# Altium schematic sheet Sheet1.SchDoc (part 2 of 2)
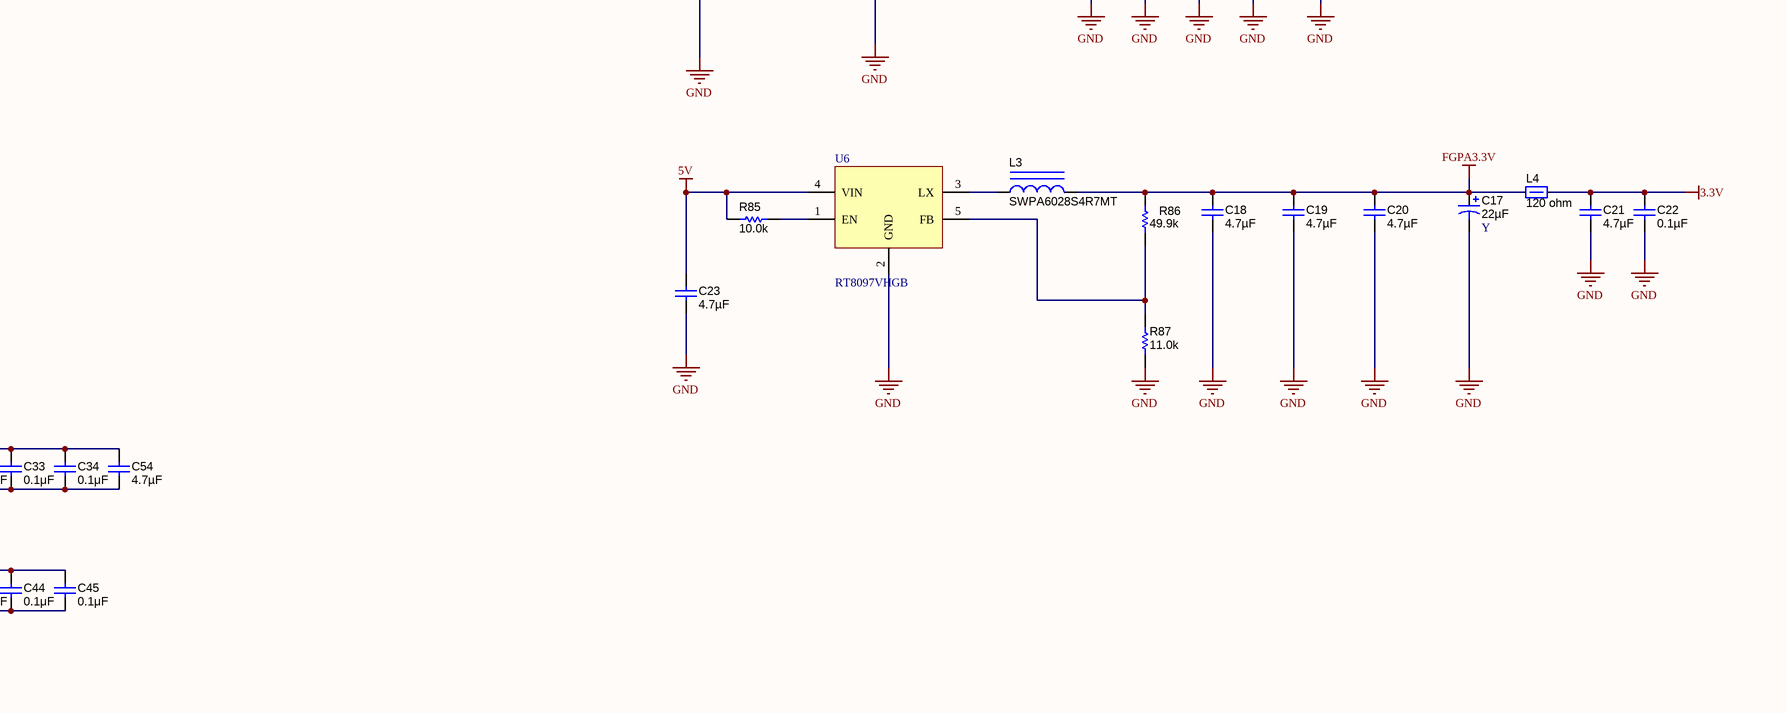
[diagram p5: Sheet1.SchDoc, bottom middle]

## Library data of the parts
D9 DD1 = PMEG2010AEH,115: Diode, Schottky, 20 V, 1 A, SOD-123F; Manufacturer: NXP Semiconductor; U/M: EA; Vf_V: 0.43; Value: 20V; Value1: 1A; Value2: 0.43V; Io_A: 1; Vr_V: 20; TJmax_C: 150; IGNORE: N; CompType: Diode; SymbolVersion: 2008-12-08; PartNumber: 1N5819; PackageReference: SOD-123F; MountType: SMT; Type: Schottky; RoHS: Y; Published: 2008-06-26; Publisher: Texas Instruments; LatestRevisionDate: 2015-04-30; ComponentLink1Description: Datasheet link; ComponentLink1URL: http://www.nxp.com/documents/data_sheet/PMEG2010AEH_PMEG2010AET.pdf; Supplier 1: Digi-Key; Supplier Part Number 1: 568-4112-1-ND; Supplier 2: Mouser; Supplier Part Number 2: 771-PMEG2010AEH-T/R; Supplier 3: Farnell; Supplier Part Number 3: 2371105
R81 R25 R26 R31 R32 R34 R35 R37 R38 R55 R68 R72 R89 R94-R96 R98 R99 = CRCW04022K21FKED: RES, 2.21 k, 1%, 0.063 W, 0402; Manufacturer: Vishay-Dale; CompType: Resistor; Value: 2.21k; Res_ohm: 2210; Value_Code: 2k21; Tolerance_%: 1; Power_W: 0.063; Value2: 0.063W; VDC_V: 50; TempCo: 100 ppm/C; EIA_Code: E96; U/M: EA; SymbolVersion: 2009-05-29; PartNumber: CRCW04022K21FKED; PackageReference: 0402; RoHS: Y; Value1: 1%; MountType: SMT; Technology: Thick Film; Published: 2008-06-26; Publisher: Texas Instruments; LatestRevisionDate: 2015-05-01; ComponentLink1Description: Datasheet link; ComponentLink1URL: http://www.vishay.com/docs/20035/dcrcwe3.pdf; Supplier 1: Digi-Key; Supplier Part Number 1: 541-2.21KLCT-ND; Supplier 2: Mouser; Supplier Part Number 2: 71-CRCW0402-2.21K-E3; Supplier 3: Farnell; Supplier Part Number 3: 1469689
? D0-D7 D11-D14 POWER1 POWER2 = LED: LED 发光二极管
BUZZER1 = BUZZER_EFBAA14D001: Buzzer, 74 dB min, 25V p-p, 8500pF @ 1kHz，直插9040无源蜂鸣器; Manufacturer: Panasonic; Area: 264,208; Value: {Value}; ComponentHeight: 0.276 inch; PackageReference: 0.550 DIA.; SymbolVersion: 07/31/2009 12:17:27; PartNumber: 直插9040无源蜂鸣器; ComponentLink1Description: AEO Datasheet Link
C1-C4 C6 C24-C27 C29-C31 C33 C34 C36-C38 C40 C41 C42C? C44 C45 C47-C50 C52 C53 C57 = C1005X7R1H104M_1: CAP, CERM, 0.1 μF, 50 V, +/- 20%, X7R, 0402; Manufacturer: TDK; Polarized: N; CompType: Capacitor; Value: 0.1uF; U/M: EA; Cap_F: 0.0000001; Tolerance_%: 20; Value1: Unknown; VDC_V: 50; Value2: 50V; TaMin_C: -55; TaMax_C: 125; SymbolVersion: 2008-07-09; PartNumber: C1005X7R1H104M; PackageReference: 0402; RoHS: Y; MountType: SMT; Technology: Ceramic; TempCo: X7R; Cap_Case: 0402; Published: 2008-06-19; Publisher: Texas Instruments; LatestRevisionDate: 2015-05-02; ComponentLink1Description: Datasheet link; Supplier 1: Digi-Key; Supplier Part Number 1: 445-5933-1-ND; Supplier 2: Farnell; Supplier Part Number 2: 1907278
C8 C64 C65 = GRM1555C1H220FA01D: CAP, CERM, 22 pF, 50 V, +/- 1%, C0G/NP0, 0402; Manufacturer: MuRata; Polarized: N; CompType: Capacitor; Value: 22pF; U/M: EA; Cap_F: 0.000000000022; Tolerance_%: 1; Value1: Unknown; VDC_V: 50; Value2: 50V; TaMin_C: -55; TaMax_C: 125; SymbolVersion: 2008-07-09; PartNumber: GRM1555C1H220FA01D; PackageReference: 0402; RoHS: Y; MountType: SMT; Technology: Ceramic; TempCo: C0G/NP0; Cap_Case: 0402; Published: 2008-06-19; Publisher: Texas Instruments; LatestRevisionDate: 2015-05-02; ComponentLink1Description: Datasheet link; ComponentLink1URL: http://search.murata.co.jp/Ceramy/image/img/A01X/partnumbering_e_01.pdf; Supplier 1: Digi-Key; Supplier Part Number 1: 490-8589-1-ND; Supplier 2: Mouser; Supplier Part Number 2: 81-GRM1555C1H220FA1D
C9 C16 C22 C35 = C1005X7R1H104M: CAP, CERM, 0.1 µF, 50 V, +/- 20%, X7R, 0402; Manufacturer: TDK; Polarized: N; CompType: Capacitor; Value: 0.1uF; U/M: EA; Cap_F: 0.0000001; Tolerance_%: 20; Value1: Unknown; VDC_V: 50; Value2: 50V; TaMin_C: -55; TaMax_C: 125; SymbolVersion: 2008-07-09; PartNumber: C1005X7R1H104M; PackageReference: 0402; RoHS: Y; MountType: SMT; Technology: Ceramic; TempCo: X7R; Cap_Case: 0402; Published: 2008-06-19; Publisher: Texas Instruments; LatestRevisionDate: 2015-05-02; ComponentLink1Description: Datasheet link; Supplier 1: Digi-Key; Supplier Part Number 1: 445-5933-1-ND; Supplier 2: Farnell; Supplier Part Number 2: 1907278
C10 C17 = 293D226X9016C2TE3: CAP, TA, 22 µF, 16 V, +/- 10%, 1.8 ohm, SMD; Manufacturer: Vishay-Sprague; CompType: Capacitor; Value: 22uF; U/M: EA; Cap_F: 0.000022; Tolerance_%: 10; Value1: 1.8 ohm; VDC_V: 16; Value2: 16V; ESR_ohm: 1.8; IRMS_A: 0.28; TaMin_C: -55; TaMax_C: 125; Cap_Case: C; Polarized: Y; SymbolVersion: 2008-07-09; PartNumber: 293D226X9016C2TE3; PackageReference: 6032-28; RoHS: Y; MountType: SMT; Technology: TA; Series: 293D; Publisher: Texas Instruments; LatestRevisionDate: 2015-03-19; LatestRevisionNote: Updated supplier links; ComponentLink1Description: Datasheet link; ComponentLink1URL: http://www.vishay.com/docs/40002/293d.pdf; Supplier 1: Digi-Key; Supplier Part Number 1: 718-1066-1-ND; Supplier 2: Mouser; Supplier Part Number 2: 74-293D226X9016C2TE3; Supplier 3: Farnell; Supplier Part Number 3: 1754187; IGNORE: Y
C11-C15 C18-C21 C23 C54 C55 = GRM21BC81C475KA88L: CAP, CERM, 4.7 µF, 16 V, +/- 10%, X6S, 0805; Manufacturer: MuRata; Polarized: N; CompType: Capacitor; Value: 4.7uF; U/M: EA; Cap_F: 0.0000047; Tolerance_%: 10; Value1: Unknown; VDC_V: 16; Value2: 16V; TaMin_C: -55; TaMax_C: 105; Cap_Case: 0805; SymbolVersion: 2008-07-09; PartNumber: GRM21BC81C475KA88L; PackageReference: 0805; RoHS: Y; MountType: SMT; Technology: Ceramic; TempCo: X6S; Published: 2008-06-19; Publisher: Texas Instruments; LatestRevisionDate: 2015-05-02; ComponentLink1Description: Datasheet link; ComponentLink1URL: http://search.murata.co.jp/Ceramy/PnsearchViewAction.do?HnOFG=ON&HnNFG=ON&SEL_CNT=50&sLang=en&sKey=GRM21BC81C475KA88L&x=9&y=9&search=startwith; Supplier 1: Digi-Key; Supplier Part Number 1: GRM21BC81C475KA88L-ND; Supplier 2: Mouser; Supplier Part Number 2: 81-GRM21BC81C475KA8L; Supplier 3: Farnell; Supplier Part Number 3: 1889279
C28 C32 C39 C43 C51 = C0402C103J5RACTU: CAP, CERM, 0.01 μF, 50 V, +/- 5%, X7R, 0402; Manufacturer: Kemet; Polarized: N; CompType: Capacitor; Value: 0.01uF; U/M: EA; Cap_F: 0.00000001; Tolerance_%: 5; Value1: Unknown; VDC_V: 50; Value2: 50V; TaMin_C: -55; TaMax_C: 125; SymbolVersion: 2008-07-09; PartNumber: C0402C103J5RACTU; PackageReference: 0402; RoHS: Y; MountType: SMT; Technology: Ceramic; TempCo: X7R; Cap_Case: 0402; Published: 2008-06-19; Publisher: Texas Instruments; LatestRevisionDate: 2015-05-02; ComponentLink1Description: Datasheet link; ComponentLink1URL: http://www.kemet.com/Lists/ProductCatalog/Attachments/53/KEM_C1002_X7R_SMD.pdf; Supplier 1: Digi-Key; Supplier Part Number 1: 399-7758-1-ND; Supplier 2: Mouser; Supplier Part Number 2: 80-C0402C103J5R; Supplier 3: Farnell; Supplier Part Number 3: 2413922
Config KEY0-KEY15 RSTn = SW-PB: 米黄色圆形按键6*6*3.4
DIG1 = 4LED-ANODE: 4位共阴数码管，红色
F1 = Fuse 2: 0.5A自恢复贴片保险丝; Published: 8-Jun-2000; LatestRevisionDate: 17-Jul-2002; LatestRevisionNote: Re-released for DXP Platform.; PackageReference: PIN-W2/E2.8; Publisher: Altium Limited; PackageDescription: Thru-Hole; 2 Leads
J1 = HTSW-102-07-G-S: Header, 100mil, 2x1, Gold, TH; PartNumber: 1x2直插圆孔，2.54mm; Manufacturer: Samtec; SymbolCreator: a0412235; U/M: EA; SymbolVersion: 2013-10-31; ClassName: Header; PackageReference: Header, 100mil, 2x1, TH; CompType: Header; RoHS: Y; MountType: TH; ComponentLink1Description: Datasheet Link; ComponentLink1URL: http://www.samtec.com/ftppub/pdf/TSW_TH.PDF; Publisher: Texas Instruments; LatestRevisionDate: 2014-11-22; Supplier 1: Digi-Key; Supplier Part Number 1: SAM8736-ND; Parameter 1: *; IGNORE: Y
JTAG UART2USB? = 105017-0001: Receptacle, Micro-USB-B, Right Angle, SMD; Manufacturer: Molex; SymbolCreator: a0412235; CompType: Connector; U/M: EA; SymbolVersion: 2012-12-19; PartNumber: micro-usb-sj20; RoHS: Y; PackageReference: Micro USB receptacle; MountType: SMT; ComponentLink1Description: Datasheet Link; ComponentLink1URL: http://www.molex.com/pdm_docs/sd/1050170001_sd.pdf; Publisher: Texas Instruments; LatestRevisionDate: 2012-12-26; LatestRevisionNote: Added parts, moved some to Hardware.IntLib; Supplier 1: Digi-Key; Supplier Part Number 1: WM1399CT-ND; Supplier 2: Mouser; Supplier Part Number 2: 538-105017-0001; Supplier 3: Farnell; Supplier Part Number 3: 1847433
L1 L3 = LPS6225-103MLB: Inductor, Shielded Drum Core, Ferrite, 4.7µH, 1.3 A, 0.1 ohm, SMD; Manufacturer: Coilcraft; Value: 10uH; Ind_H: 10.0E-6; Imax_A: 1.3; Irms: 1.3A @ 40C rise; Isat: 2.2A @ 30% inductance drop; DCR_ohm: 0.1; Value1: 0.1 ohm; Value2: 1.3A; SymbolVersion: 2008-07-23; CompType: Inductor; PartNumber: SWPA6028S4R7MT; ValueDisplayed: 4.7µH; Technology: Shielded Drum Core; MountType: SMT; Material: Ferrite; PackageReference: LPS6225; Published: 2008-06-26; Publisher: Texas Instruments; LatestRevisionDate: 2015-04-27; ComponentLink1Description: Datasheet link; ComponentLink1URL: http://www.coilcraft.com/pdfs/lps6225.pdf; RoHS: Y
L4 L5 = BLM21BD121SN1D: Ferrite Bead, 120 ohm @ 100 MHz, 0.2 A, 0805; Manufacturer: MuRata; Imax_A: 0.2; DCR_ohm: 0.25; Value1: 0.25 ohm; Value2: 0.2A; ZTyp@100MHz_Ohm: 120; CompType: Ferrite Bead; SymbolVersion: 2009-06-02; PartNumber: GZ2012V121TF; MountType: SMT; PackageReference: 0805; Published: 2014-04-30; Publisher: Texas Instruments; LatestRevisionDate: 2015-05-01; ComponentLink1Description: Datasheet link; ComponentLink1URL: http://search.murata.co.jp/Ceramy/image/img/PDF/ENG/L0110S0100BLM21B.pdf; RoHS: Y; Supplier 1: Digi-Key; Supplier Part Number 1: 490-1044-1-ND; Supplier 2: Mouser; Supplier Part Number 2: 81-BLM21BD121SN1D; Supplier 3: Farnell; Supplier Part Number 3: 1515637
P1 P4 = Header 30X2: Header, 30-Pin, Dual row30X2排针，2.54mm; LatestRevisionDate: 17-Jul-2002; LatestRevisionNote: Re-released for DXP Platform.; Publisher: Altium Limited; IGNORE: Y
P2 P3 = Header 20X2: 贴片2.54mm，2x20,双排孔; LatestRevisionDate: 17-Jul-2002; LatestRevisionNote: Re-released for DXP Platform.; Publisher: Altium Limited
P5 = Header 12X2_1: Header, 12-Pin, Dual row; LatestRevisionDate: 17-Jul-2002; LatestRevisionNote: Re-released for DXP Platform.; Publisher: Altium Limited; IGNORE: Y
P6 = Header 12X2: Header, 12-Pin, Dual row; LatestRevisionDate: 17-Jul-2002; LatestRevisionNote: Re-released for DXP Platform.; Publisher: Altium Limited
Q1 = MMBT3906, Fairchild Semiconductor: Transistor, PNP, 40 V, 0.2 A, SOT-23; CompType: BJT; PNP: 1; NPN: 0; Vceo_V: 40; Vcesat1_V: 0.25; Value: 40 V; IcRated_A: 0.2; Value1: 0.2 A; HfeMax: 300; TaMin_C: -55; TaMax_C: 150; U/M: EA; SymbolVersion: 2008-07-31; PartNumber: MMBT3906; Manufacturer: Fairchild Semiconductor; PackageReference: SOT-23; RoHS: Y; Value2: 300; Published: 2008-07-31; LatestRevisionDate: 2015-04-27; Publisher: Texas Instruments; ComponentLink1Description: Datasheet link; ComponentLink1URL: http://www.fairchildsemi.com/ds/MM/MMBT3906.pdf; Supplier 1: Digi-Key; Supplier Part Number 1: MMBT3906FSCT-ND; Supplier 2: Farnell; Supplier Part Number 2: 9846832; MountType: SMT
R1-R4 R9-R12 R17-R24 R45 = CRCW04021K00FKED: RES, 1.00 k, 1%, 0.063 W, 0402; Manufacturer: Vishay-Dale; CompType: Resistor; Value: 1.00k; Res_ohm: 1000; Value_Code: 1k00; Tolerance_%: 1; Power_W: 0.063; Value2: 0.063W; VDC_V: 50; TempCo: 100 ppm/C; EIA_Code: E96; U/M: EA; SymbolVersion: 2009-05-29; PartNumber: CRCW04021K00FKED; PackageReference: 0402; RoHS: Y; Value1: 1%; MountType: SMT; Technology: Thick Film; Published: 2008-06-26; Publisher: Texas Instruments; LatestRevisionDate: 2015-05-01; ComponentLink1Description: Datasheet link; ComponentLink1URL: http://www.vishay.com/docs/20035/dcrcwe3.pdf; Supplier 1: Digi-Key; Supplier Part Number 1: 541-1.00KLCT-ND; Supplier 2: Mouser; Supplier Part Number 2: 71-CRCW0402-1.0K-E3; Supplier 3: Farnell; Supplier Part Number 3: 1469662
R5-R8 R13-R16 = RG1005P-301-B-T5: RES, 300, 0.1%, 0.063 W, 0402; Manufacturer: Susumu Co Ltd; CompType: Resistor; Value: 300; Value_Code: 300R; Tolerance_%: 0.1; Power_W: 0.063; Value2: 0.063W; VDC_V: 50; TempCo: 25 ppm/C; U/M: EA; SymbolVersion: 2009-05-29; PartNumber: RG1005P-301-B-T5; PackageReference: 0402; RoHS: Y; Res_ohm: 300; Value1: 0.1%; MountType: SMT; Technology: Thin Film; Published: 2008-06-26; Publisher: Texas Instruments; LatestRevisionDate: 2015-05-01; ComponentLink1Description: Datasheet link; ComponentLink1URL: http://www.susumu-usa.com/pdf/RG_Data_Sheet.pdf; Supplier 1: Digi-Key; Supplier Part Number 1: RG10P300BCT-ND; Supplier 2: Mouser; Supplier Part Number 2: 754-RG1005P-301-B-T5
R27-R30 R54 R56-R62 R65 R82-R85 R88 R90 R91 R100 = CRCW040210K0FKED: RES, 10.0 k, 1%, 0.063 W, 0402; Manufacturer: Vishay-Dale; CompType: Resistor; Value: 10.0k; Res_ohm: 10000; Value_Code: 10k0; Tolerance_%: 1; Power_W: 0.063; Value2: 0.063W; VDC_V: 50; TempCo: 100 ppm/C; EIA_Code: E96; U/M: EA; SymbolVersion: 2009-05-29; PartNumber: CRCW040210K0FKED; PackageReference: 0402; RoHS: Y; Value1: 1%; MountType: SMT; Technology: Thick Film; Published: 2008-06-26; Publisher: Texas Instruments; LatestRevisionDate: 2015-05-01; ComponentLink1Description: Datasheet link; ComponentLink1URL: http://www.vishay.com/docs/20035/dcrcwe3.pdf; Supplier 1: Digi-Key; Supplier Part Number 1: 541-10.0KLCT-ND; Supplier 2: Mouser; Supplier Part Number 2: 71-CRCW0402-10K-E3; Supplier 3: Farnell; Supplier Part Number 3: 1469669
R33 R36 R39-R44 = CRCW0402100RFKED: RES, 100, 1%, 0.063 W, 0402; Manufacturer: Vishay-Dale; CompType: Resistor; Value: 100; Value_Code: 100R; Tolerance_%: 1; Power_W: 0.063; Value2: 0.063W; VDC_V: 50; TempCo: 100 ppm/C; EIA_Code: E96; U/M: EA; SymbolVersion: 2009-05-29; PartNumber: CRCW0402100RFKED; PackageReference: 0402; RoHS: Y; Res_ohm: 100; Value1: 1%; MountType: SMT; Technology: Thick Film; Published: 2008-06-26; Publisher: Texas Instruments; LatestRevisionDate: 2015-05-01; ComponentLink1Description: Datasheet link; ComponentLink1URL: http://www.vishay.com/docs/20035/dcrcwe3.pdf; Supplier 1: Digi-Key; Supplier Part Number 1: 541-100LCT-ND; Supplier 2: Mouser; Supplier Part Number 2: 71-CRCW0402-100-E3; Supplier 3: Farnell; Supplier Part Number 3: 1469672
R46-R53 R63 = CRCW040220K0FKED: RES, 20.0 k, 1%, 0.063 W, 0402; Manufacturer: Vishay-Dale; CompType: Resistor; Value: 20.0k; Res_ohm: 20000; Value_Code: 20k0; Tolerance_%: 1; Power_W: 0.063; Value2: 0.063W; VDC_V: 50; TempCo: 100 ppm/C; EIA_Code: E96; U/M: EA; SymbolVersion: 2009-05-29; PartNumber: CRCW040220K0FKED; PackageReference: 0402; RoHS: Y; Value1: 1%; MountType: SMT; Technology: Thick Film; Published: 2008-06-26; Publisher: Texas Instruments; LatestRevisionDate: 2015-05-01; ComponentLink1Description: Datasheet link; ComponentLink1URL: http://www.vishay.com/docs/20035/dcrcwe3.pdf; Supplier 1: Digi-Key; Supplier Part Number 1: 541-20.0KLCT-ND; Supplier 2: Mouser; Supplier Part Number 2: 71-CRCW0402-20K-E3; Supplier 3: Farnell; Supplier Part Number 3: 1469693
R66 R67 R97 R101 R102 = CRCW040222R1FKED: RES, 22.1, 1%, 0.063 W, 0402; Manufacturer: Vishay-Dale; CompType: Resistor; Value: 22.1; Value_Code: 22R1; Tolerance_%: 1; Power_W: 0.063; Value2: 0.063W; VDC_V: 50; TempCo: 100 ppm/C; EIA_Code: E96; U/M: EA; SymbolVersion: 2009-05-29; PartNumber: CRCW040222R1FKED; PackageReference: 0402; RoHS: Y; Res_ohm: 22.1; Value1: 1%; MountType: SMT; Technology: Thick Film; Published: 2008-06-26; Publisher: Texas Instruments; LatestRevisionDate: 2015-05-01; ComponentLink1Description: Datasheet link; ComponentLink1URL: http://www.vishay.com/docs/20035/dcrcwe3.pdf; Supplier 1: Digi-Key; Supplier Part Number 1: 541-22.1LCT-ND; Supplier 2: Mouser; Supplier Part Number 2: 71-CRCW0402-22.1-E3; Supplier 3: Farnell; Supplier Part Number 3: 1469698
R69 R? = CRCW04021K50FKED: RES, 1.50 k, 1%, 0.063 W, 0402; Manufacturer: Vishay-Dale; CompType: Resistor; Value: 1.50k; Res_ohm: 1500; Value_Code: 1k50; Tolerance_%: 1; Power_W: 0.063; Value2: 0.063W; VDC_V: 50; TempCo: 100 ppm/C; EIA_Code: E96; U/M: EA; SymbolVersion: 2009-05-29; PartNumber: CRCW04021K50FKED; PackageReference: 0402; RoHS: Y; Value1: 1%; MountType: SMT; Technology: Thick Film; Published: 2008-06-26; Publisher: Texas Instruments; LatestRevisionDate: 2015-05-01; ComponentLink1Description: Datasheet link; ComponentLink1URL: http://www.vishay.com/docs/20035/dcrcwe3.pdf; Supplier 1: Digi-Key; Supplier Part Number 1: 541-1.50KLCT-ND; Supplier 2: Mouser; Supplier Part Number 2: 71-CRCW0402-1.5K-E3; Supplier 3: Farnell; Supplier Part Number 3: 1653201
R70 R71 R75-R80 = CRCW04020000Z0ED: RES, 0, 5%, 0.063 W, 0402; Manufacturer: Vishay-Dale; CompType: Resistor; Value: 0; Value_Code: 0000; Tolerance_%: 5; Power_W: 0.063; Value2: 0.063W; VDC_V: 50; TempCo: 200 ppm/C; EIA_Code: E24; U/M: EA; SymbolVersion: 2009-05-29; PartNumber: CRCW04020000Z0ED; PackageReference: 0402; RoHS: Y; Res_ohm: 0; Value1: 5%; MountType: SMT; Technology: Thick Film; Published: 2008-06-26; Publisher: Texas Instruments; LatestRevisionDate: 2015-05-01; ComponentLink1Description: Datasheet link; ComponentLink1URL: http://www.vishay.com/docs/20035/dcrcwe3.pdf; Supplier 1: Digi-Key; Supplier Part Number 1: 541-0.0JCT-ND; Supplier 2: Mouser; Supplier Part Number 2: 71-CRCW0402-0-E3; Supplier 3: Farnell; Supplier Part Number 3: 1469661
R73 R74 = CRCW04024K75FKED: RES, 4.75 k, 1%, 0.063 W, 0402; Manufacturer: Vishay-Dale; CompType: Resistor; Value: 4.75k; Res_ohm: 4750; Value_Code: 4k75; Tolerance_%: 1; Power_W: 0.063; Value2: 0.063W; VDC_V: 50; TempCo: 100 ppm/C; EIA_Code: E96; U/M: EA; SymbolVersion: 2009-05-29; PartNumber: CRCW04024K75FKED; PackageReference: 0402; RoHS: Y; Value1: 1%; MountType: SMT; Technology: Thick Film; Published: 2008-06-26; Publisher: Texas Instruments; LatestRevisionDate: 2015-05-01; ComponentLink1Description: Datasheet link; ComponentLink1URL: http://www.vishay.com/docs/20035/dcrcwe3.pdf; Supplier 1: Digi-Key; Supplier Part Number 1: 541-4.75KLCT-ND; Supplier 2: Mouser; Supplier Part Number 2: 71-CRCW0402-4.75K-E3; Supplier 3: Farnell; Supplier Part Number 3: 1469713
R86 = CRCW040249K9FKED: RES, 49.9 k, 1%, 0.063 W, 0402; Manufacturer: Vishay-Dale; CompType: Resistor; Value: 49.9k; Res_ohm: 49900; Value_Code: 49k9; Tolerance_%: 1; Power_W: 0.063; Value2: 0.063W; VDC_V: 50; TempCo: 100 ppm/C; EIA_Code: E96; U/M: EA; SymbolVersion: 2009-05-29; PartNumber: CRCW040249K9FKED; PackageReference: 0402; RoHS: Y; Value1: 1%; MountType: SMT; Technology: Thick Film; Published: 2008-06-26; Publisher: Texas Instruments; LatestRevisionDate: 2015-05-01; ComponentLink1Description: Datasheet link; ComponentLink1URL: http://www.vishay.com/docs/20035/dcrcwe3.pdf; Supplier 1: Digi-Key; Supplier Part Number 1: 541-49.9KLCT-ND; Supplier 2: Mouser; Supplier Part Number 2: 71-CRCW0402-49.9K-E3; Supplier 3: Farnell; Supplier Part Number 3: 1469720
R87 = CRCW040211K0FKED: RES, 11.0 k, 1%, 0.063 W, 0402; Manufacturer: Vishay-Dale; CompType: Resistor; Value: 11.0k; Res_ohm: 11000; Value_Code: 11k0; Tolerance_%: 1; Power_W: 0.063; Value2: 0.063W; VDC_V: 50; TempCo: 100 ppm/C; EIA_Code: E96; U/M: EA; SymbolVersion: 2009-05-29; PartNumber: CRCW040211K0FKED; PackageReference: 0402; RoHS: Y; Value1: 1%; MountType: SMT; Technology: Thick Film; Published: 2008-06-26; Publisher: Texas Instruments; LatestRevisionDate: 2015-05-01; ComponentLink1Description: Datasheet link; ComponentLink1URL: http://www.vishay.com/docs/20035/dcrcwe3.pdf; Supplier 1: Digi-Key; Supplier Part Number 1: 541-11.0KLCT-ND; Supplier 2: Mouser; Supplier Part Number 2: 71-CRCW0402-11K-E3; Supplier 3: Farnell; Supplier Part Number 3: 1469673
R92 R93 = CRCW0402470RJNED: RES, 470, 5%, 0.063 W, 0402; Manufacturer: Vishay-Dale; CompType: Resistor; Value: 470; Value_Code: 470R; Tolerance_%: 5; Power_W: 0.063; Value2: 0.063W; VDC_V: 50; TempCo: 200 ppm/C; EIA_Code: E24; U/M: EA; SymbolVersion: 2009-05-29; PartNumber: CRCW0402470RJNED; PackageReference: 0402; RoHS: Y; Res_ohm: 470; Value1: 5%; MountType: SMT; Technology: Thick Film; Published: 2008-06-26; Publisher: Texas Instruments; LatestRevisionDate: 2015-05-01; ComponentLink1Description: Datasheet link; ComponentLink1URL: http://www.vishay.com/docs/20035/dcrcwe3.pdf; Supplier 1: Digi-Key; Supplier Part Number 1: 541-470JCT-ND; Supplier 2: Mouser; Supplier Part Number 2: 71-CRCW0402J-470-E3; Supplier 3: Farnell; Supplier Part Number 3: 1537425
SW0-SW7 = SW-SPDT: SPDT Subminiature Toggle Switch, Right Angle Mounting, Vertical Actuation; Published: 24-Mar-1999; LatestRevisionDate: 17-Dec-2003; LatestRevisionNote: Schematic revised, PCB Footprint replaced.; DatasheetVersion: 05-Dec-2000; PackageReference: TL36WW15050; Publisher: Altium Limited; PackageDescription: Switch; 4 Leads; ComponentLink1Description: Manufacturer Link; ComponentLink1URL: http://www.apem.com
T1-T14 = 5000: Test Point, TH, Miniature, Red; Manufacturer: Keystone; CompType: Test Point Loop; U/M: EA; SymbolVersion: 2008-04-04; PartNumber: 5000; Value: Red; RoHS: Y; PackageReference: Keystone5000; MountType: TH; ComponentLink1Description: Datasheet Link; ComponentLink1URL: http://www.keyelco.com/pdfs/M55p51.pdf; Publisher: Texas Instruments; LatestRevisionDate: 2012-12-26; LatestRevisionNote: Added parts, moved some to Hardware.IntLib; Supplier 1: Digi-Key; Supplier Part Number 1: 5000K-ND
U1 = LM321MF: Low Power Single Op Amp, DBV0005A; Manufacturer: Texas Instruments; SymbolCreator: a0411595; CompType: OpAmp IC; SymbolVersion: 2015-01-06; PartNumber: SGM321YN5/TR; PackageReference: DBV0005A; MountType: SMT; Publisher: Texas Instruments; LatestRevisionDate: 2015-02-03; Alternate Manufacturer: Texas Instruments; ComponentLink1Description: LM321 Datasheet; ComponentLink1URL: http://www.ti.com/lit/gpn/LM321; ComponentLink2Description: LM321 Web Page; ComponentLink2URL: http://www.ti.com/product/LM321; ComponentLink3Description: SOT Package Web Page; ComponentLink3URL: http://www.ti.com/sc/docs/psheets/type/sot.html
U2 = CH340G: USB2UART
U3 U30 = TPD4E001DBVR: Low-Capacitance + / - 15-kV ESD Protection Array for High-Speed Data Interfaces, 4 Channels, -40 to +85 degC, 6-pin SOT-23 (DBV), Green (RoHS & no Sb/Br); Manufacturer: Texas Instruments; Alternate Manufacturer: None; Alternate PartNumber: Equivalent; 1394 / Firewire: TRUE; Breakdown Voltage(Min)(V): 11; IEC 61000-4-2 Air-Gap(+/- kV): 15; IEC 61000-4-2 Contact(+/- kV): 8; IO Capacitance(Typ)(pF): 1.5; SubFamily: ESD Solution; DatasheetVersion: SLLS682G; PackageVersion: revK, Mar-2006; PackageReference: DBV0006A; PackageDescription: 6-Pin Plastic Small-Outline Package, 2.9 x 1.6 mm Body, 0.95 mm Pitch, 2.8 mm Lead Span; Supplier 1: Digi-Key; Supplier Part Number 1: 296-28203-2-ND; Supplier 2: Digi-Key; Supplier Part Number 2: 296-28203-1-ND; Supplier 3: Digi-Key; Supplier Part Number 3: 296-28203-6-ND; Supplier 4: Newark; Supplier Part Number 4: 27T6836; Supplier 5: Mouser; Supplier Part Number 5: 595-TPD4E001DBVR; Eco-Plan: Green (RoHS & no Sb/Br); IO Leakage Current(nA): 1.5; Serial ATA / eSATA: TRUE; USB High Speed: TRUE; MountType: SMT; Code_JEDEC: MO-178-AB*; PartNumber: TPD4E001DBVR; ComponentLink1Description: Datasheet; ComponentLink1URL: http://www.ti.com/general/docs/lit/getliterature.tsp?genericPartNumber=TPD4E001&fileType=pdf; ComponentLink2Description: URL Link1; ComponentLink2URL: SamplesURL:http://www.ti.com/product/tpd4e001#samples
U4 = GD32F150U: ComponentLink1Description: Manufacturer URL; ComponentLink1URL: http://www.ti.com/; ComponentLink2Description: Datasheet; ComponentLink2URL: http://www.ti.com/general/docs/lit/getliterature.tsp?genericPartNumber=DAC904&fileType=pdf; ComponentLink3Description: Package Specification; ComponentLink3URL: http://www.ti.com/litv/pdf/mpds364
U5 U6 = RT8097: 1MHZ,2A,STEP-DOWM DC/DC; Partnumber: MT3520B
U8 = W25Q80BLSNIG: 2.5V 8M-Bit Serial Flash Memory with Dual and Quad SPI, SOIC-8; Manufacturer: Winbond; SymbolCreator: Altium; SymbolVersion: 2015-04-01; PartNumber: W25Q16; MountType: SMT; ComponentLink1Description: Datasheet Link; ComponentLink1URL: http://www.winbond.com/resource-files/da00-w25q80blf1.pdf; RoHS: Y; PackageReference: SOIC-8; Publisher: Texas Instruments; LatestRevisionDate: 2015-05-05; Supplier 1: Digi-Key; Supplier Part Number 1: W25Q80BLSNIG-ND
U11 = AMS1117: LDO电源
Y0 = ABLS-8.000MHZ-B4-T: Crystal, 12MHz, 18pF, SMD,无源; Manufacturer: Abracon Corportation; SymbolCreator: a0412235; U/M: EA; TaMin_C: 0; TaMax_C: 70; Frequency Stability: ±50ppm; SymbolVersion: 2008-07-09; PartNumber: ABLS-12.000MHZ-B4-T; CompType: Crystal; PackageReference: Crystal, 11.4x4.3x3.8mm; MountType: SMT; RoHS: Y; ComponentLink1Description: Datasheet Link; ComponentLink1URL: http://www.abracon.com/Resonators/abls.pdf; Publisher: Texas Instruments; LatestRevisionDate: 2015-05-05; Supplier 1: Digi-Key; Supplier Part Number 1: 535-10212-1-ND; Supplier 2: Mouser; Supplier Part Number 2: 815-ABLS-8.0M-T
Y3 = 7X-20.000MBB-T: Crystal, 有源晶振，Sealed Locked 24MHz, 15pF, SMD; Manufacturer: TXC Corporation; SymbolCreator: a0799628; CompType: Oscillator; U/M: EA; TaMin_C: -40; TaMax_C: 85; Frequency Stability: ?ppm; SymbolVersion: 2013-06-14; PartNumber: 7X-24.000MBB-T; PackageReference: 3.2x1x2.5 mm; MountType: SMT; RoHS: Y; ComponentLink1Description: Datasheet Link; ComponentLink1URL: http://www.txccrystal.com/images/pdf/7x.pdf; Publisher: Texas Instruments; LatestRevisionDate: 2013-06-18; LatestRevisionNote: Changed publisher; Supplier 1: Digi-Key; Supplier Part Number 1: 887-1217-1-ND; Supplier 2: Mouser; Supplier Part Number 2: 717-7X-20.000MBB-T; Supplier 3: Farnell; Supplier Part Number 3: 1842164